# Altium project FRDMShieldTemplateProject.PrjPcb
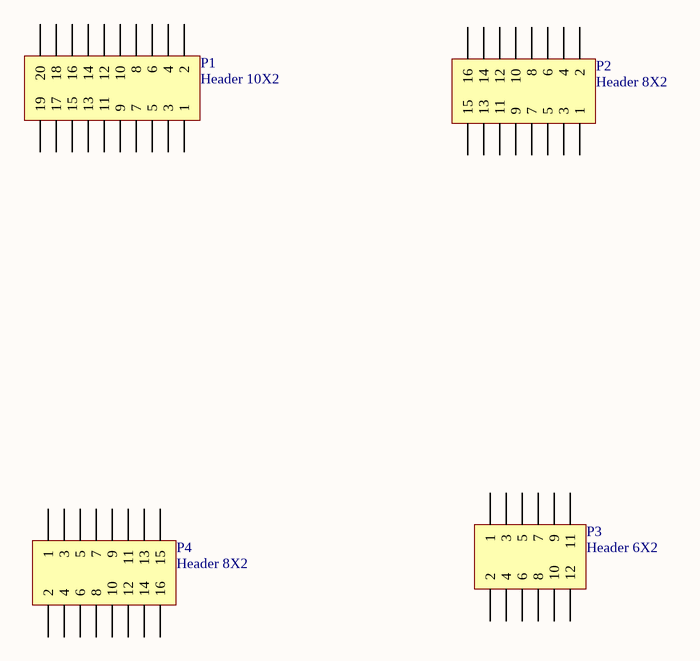
[diagram p0: FRDMShieldTemplateProject.SchDoc]
DraftsmanName: [GlobalDraftsmanName]; EngineerName: [GlobalEngineerName]; GlobalDate: [GlobalDate]; GlobalTitle: [GlobalTitle]; RevNumber: [GlobalRevNumber]
1 sheet, 4 parts. Net scope: global (net labels, ports and power ports of the same name join across sheets).
Board file: FRDMShieldTemplateProject.PcbDoc

## Sheet FRDMShieldTemplateProject.SchDoc: [SheetTitle]
size B; Date: [Date]

### Parts
P1  Header 10X2  [HDR2X10]
P2  Header 8X2  [HDR2X8]
P3  Header 6X2  [HDR2X6]
P4  Header 8X2  [HDR2X8]

### Nets

Not connected (* = marked no-connect by the designer): P1 1 2 3 4 5 6 7 8 9 10 11 12 13 14 15 16 17 18 19 20; P2 1 2 3 4 5 6 7 8 9 10 11 12 13 14 15 16; P3 1 2 3 4 5 6 7 8 9 10 11 12; P4 1 2 3 4 5 6 7 8 9 10 11 12 13 14 15 16

### Notes on the sheet
- Sheet Title:
- Project Title:
- Engineer:
- Draftsman:
- Date:
- Size:
- B
- Revision:
- Sheet:        of

### Library data of the parts
P1 = Header 10X2: Header, 10-Pin, Dual row; LatestRevisionDate: 17-Jul-2002; LatestRevisionNote: Re-released for DXP Platform.; Publisher: Altium Limited
P2 P4 = Header 8X2: Header, 8-Pin, Dual row; LatestRevisionDate: 17-Jul-2002; LatestRevisionNote: Re-released for DXP Platform.; Publisher: Altium Limited
P3 = Header 6X2: Header, 6-Pin, Dual row; LatestRevisionDate: 17-Jul-2002; LatestRevisionNote: Re-released for DXP Platform.; Publisher: Altium Limited